# Altium schematic sheet SMPS power supply.SchDoc: SMPS power supply
size A3; DocumentNumber: MB1312; Revision: A-01; SheetNumber: 6; SheetTotal: 6; Project: NUCLEO-LXXXZX
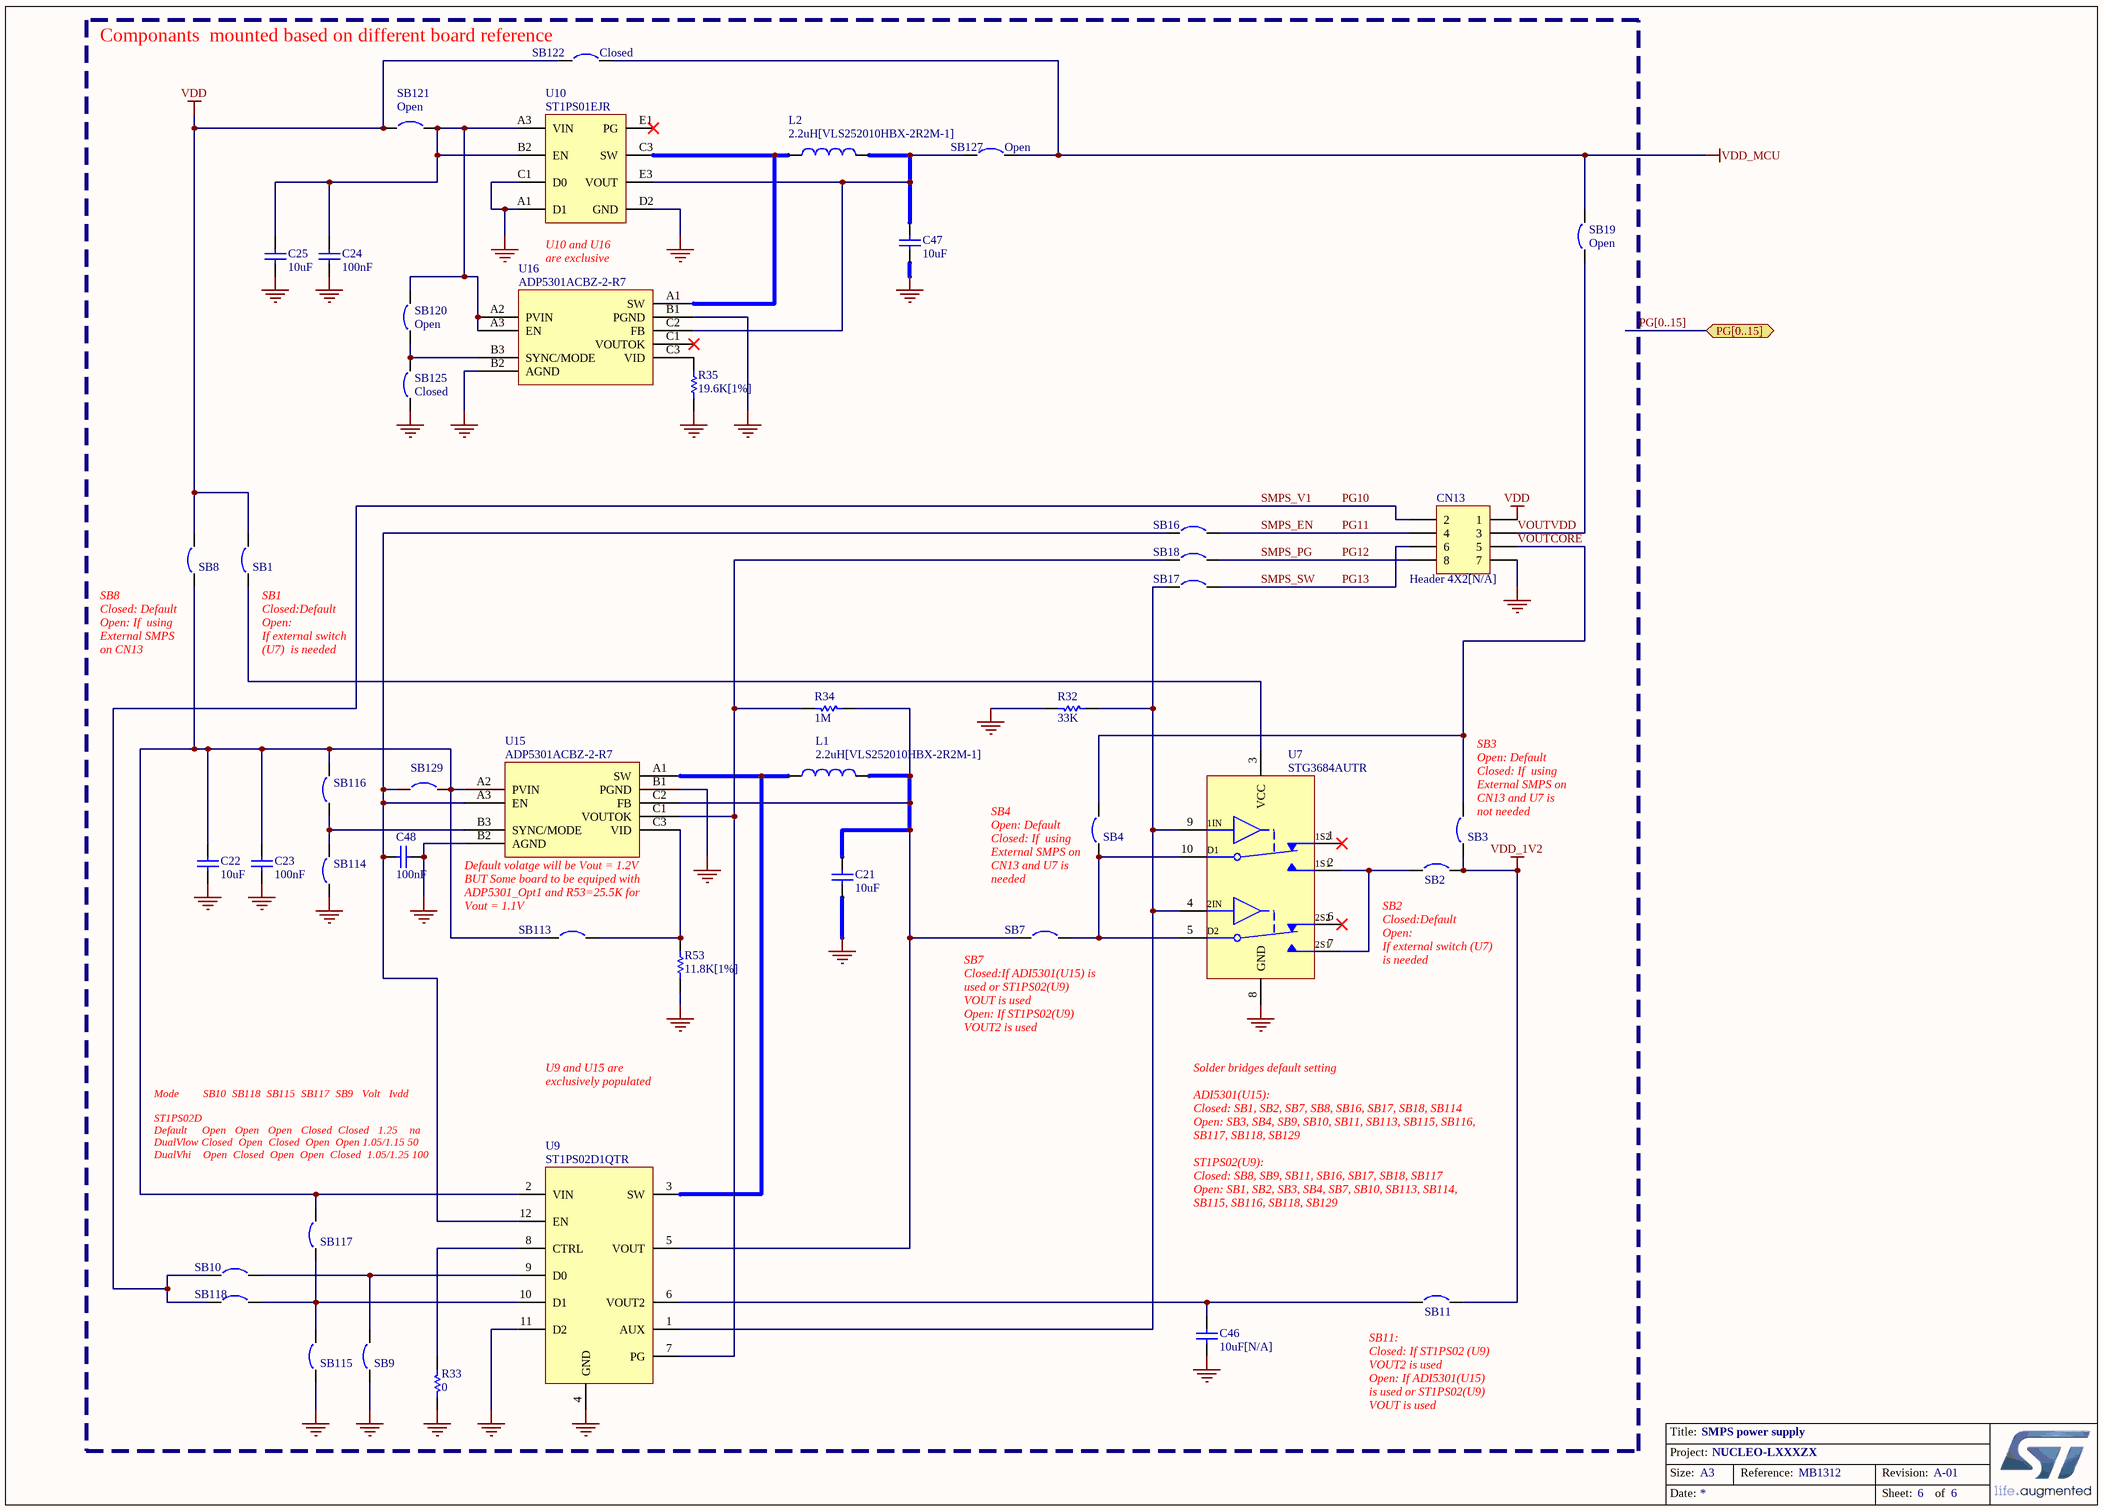
[diagram p0: SMPS power supply.SchDoc]

## Parts
C21  10uF  [0603C]
C22  10uF  [0603C]
C23  100nF  [0603C]
C24  100nF  [0603C]
C25  10uF  [0603C]
C46  10uF[N/A]  [0603C]
C47  10uF  [0603C]
C48  100nF  [0603C]
CN13  Header 4X2[N/A]  [HDR_4x2_2R54_V_M]
L1  2.2uH[VLS252010HBX-2R2M-1]  [L1008_L0805_CPT]
L2  2.2uH[VLS252010HBX-2R2M-1]  [L1008_L0805_CPT]
R32  33K  [0603R]
R33  0  [0603R]
R34  1M  [0603R]
R35  19.6K[1%]  [0603R]
R53  11.8K[1%]  [0603R]
SB1  Circuit Breaker  [SB_0603]  (value not drawn)
SB2  Circuit Breaker  [SB_0603]  (value not drawn)
SB3  Circuit Breaker  [SB_0603]  (value not drawn)
SB4  Circuit Breaker  [SB_0603]  (value not drawn)
SB7  Circuit Breaker  [SB_0603]  (value not drawn)
SB8  Circuit Breaker  [SB_0603]  (value not drawn)
SB9  Circuit Breaker  [SB_0603]  (value not drawn)
SB10  Circuit Breaker  [SB_0603]  (value not drawn)
SB11  Circuit Breaker  [SB_0603]  (value not drawn)
SB16  Circuit Breaker  [SB_0603]  (value not drawn)
SB17  Circuit Breaker  [SB_0603]  (value not drawn)
SB18  Circuit Breaker  [SB_0603]  (value not drawn)
SB19  Open  [SB_0603]
SB113  Open  [SB_0603]  (value not drawn)
SB114  Closed  [SB_0603]  (value not drawn)
SB115  Circuit Breaker  [SB_0603]  (value not drawn)
SB116  Open  [SB_0603]  (value not drawn)
SB117  Circuit Breaker  [SB_0603]  (value not drawn)
SB118  Circuit Breaker  [SB_0603]  (value not drawn)
SB120  Open  [SB_0603]
SB121  Open  [SB_0603]
SB122  Closed  [SB_0603]
SB125  Closed  [SB_0603]
SB127  Open  [SB_0603]
SB129  Open  [SB_0603]  (value not drawn)
U7  STG3684AUTR  [QFN40P180X140X55-10N]
U9  ST1PS02D1QTR  [QFN0P170X200X55-12N]
U10  ST1PS01EJR  [Flipchip8]
U15  ADP5301ACBZ-2-R7  [WLCSP-9ball]
U16  ADP5301ACBZ-2-R7  [WLCSP-9ball]

## Blocks framed on the sheet
Componants  mounted based on different board reference: C21-C25 C46-C48 CN13 L1 L2 R32-R35 R53 SB1-SB4 SB7-SB11 SB16-SB19 SB113-SB118 SB120-SB122 SB125 SB127 SB129 U7 U9 U10 U15 U16

## Ports
PG[0..15] (bidir)

## Nets
GND: C21.1 C22.1 C23.2 C24.2 C25.1 C46.1 C47.1 C48.2 CN13.7 R32.2 R33.1 R35.1 R53.1 SB9.1 SB114.1 SB115.1 SB125.1 U7.8(GND) U9.4(GND) U9.11(D2) U10.A1(D1) U10.C1(D0) U10.D2(GND) U15.B1(PGND) U15.B2(AGND) U16.B1(PGND) U16.B2(AGND)
VDD: CN13.1 SB1.2 SB8.2 SB121.1 SB122.1
VDD_1V2: SB2.2 SB3.1 SB11.2
VDD_MCU: SB19.2 SB122.2 SB127.2
PG10: CN13.2 SB10.1 SB118.1  [also labelled SMPS_V1]
PG11: CN13.4 SB16.2  [also labelled SMPS_EN]
PG12: CN13.8 SB18.2  [also labelled SMPS_PG]
PG13: CN13.6 SB17.2  [also labelled SMPS_SW]
VOUTCORE: CN13.5 SB3.2 SB4.2
VOUTVDD: CN13.3 SB19.1
NetC21_2: C21.2 L1.2 R34.1 SB7.1 U9.5(VOUT) U15.C2(FB)
NetC22_2: C22.2 C23.1 SB8.1 SB113.1 SB116.2 SB117.2 SB129.2 U9.2(VIN) U15.A2(PVIN)
NetC24_1: C24.1 C25.2 SB120.2 SB121.2 U10.A3(VIN) U10.B2(EN) U16.A2(PVIN) U16.A3(EN)
NetC46_2: C46.2 SB11.1 U9.6(VOUT2)
NetC47_2: C47.2 L2.2 SB127.1 U10.E3(VOUT) U16.C2(FB)
NetC48_1: C48.1 SB16.1 SB129.1 U9.12(EN) U15.A3(EN)
NetL1_1: L1.1 U9.3(SW) U15.A1(SW)
NetL2_1: L2.1 U10.C3(SW) U16.A1(SW)
NetR32_1: R32.1 SB17.1 U7.4(2IN) U7.9(1IN) U9.1(AUX)
NetR33_2: R33.2 U9.8(CTRL)
NetR34_2: R34.2 SB18.1 U9.7(PG) U15.C1(VOUTOK)
NetR35_2: R35.2 U16.C3(VID)
NetR53_2: R53.2 SB113.2 U15.C3(VID)
NetSB1_1: SB1.1 U7.3(VCC)
NetSB2_1: SB2.1 U7.2(1S1) U7.7(2S1)
NetSB4_1: SB4.1 SB7.2 U7.5(D2) U7.10(D1)
NetSB9_2: SB9.2 SB10.2 U9.9(D0)
NetSB114_2: SB114.2 SB116.1 U15.B3(SYNC/MODE)
NetSB115_2: SB115.2 SB117.1 SB118.2 U9.10(D1)
NetSB120_1: SB120.1 SB125.2 U16.B3(SYNC/MODE)

Not connected (* = marked no-connect by the designer): U7 1(1S2)* 6(2S2)*; U10 E1(PG)*; U16 C1(VOUTOK)*

## Buses and harness runs
bus PG[0..15] = port PG[0..15]

## Notes on the sheet
- U10 and U16 are exclusive
- (near SB1) SB1
  Closed:Default
  Open:
  If external switch (U7)  is needed
- (near SB8) SB8
  Closed: Default
  Open: If  using External SMPS on CN13
- (near SB3) SB3
  Open: Default
  Closed: If  using External SMPS on CN13 and U7 is not needed
- Default volatge will be Vout = 1.2V
  BUT Some board to be equiped with ADP5301_Opt1 and R53=25.5K for Vout = 1.1V
- (near SB4) SB4
  Open: Default
  Closed: If  using External SMPS on CN13 and U7 is needed
- (near SB2) SB2
  Closed:Default
  Open:
  If external switch (U7)  is needed
- U9 and U15 are exclusively populated
- (near SB7) SB7
  Closed:If ADI5301(U15) is used or ST1PS02(U9) VOUT is used
  Open: If ST1PS02(U9) VOUT2 is used
- (near SB117) Mode        SB10  SB118  SB115  SB117  SB9   Volt   Ivdd
  ST1PS02D
  Default     Open   Open   Open   Closed  Closed   1.25    na
  DualVlow Closed  Open  Closed  Open  Open 1.05/1.15 50
  DualVhi    Open  Closed  Open  Open  Closed  1.05/1.25 100
- Solder bridges default setting
  ADI5301(U15):
  Closed: SB1, SB2, SB7, SB8, SB16, SB17, SB18, SB114
  Open: SB3, SB4, SB9, SB10, SB11, SB113, SB115, SB116, SB117, SB118, SB129
  ST1PS02(U9):
  Closed: SB8, SB9, SB11, SB16, SB17, SB18, SB117
  Open: SB1, SB2, SB3, SB4, SB7, SB10, SB113, SB114, SB115, SB116, SB118, SB129
- (near SB11) SB11:
  Closed: If ST1PS02 (U9) VOUT2 is used
  Open: If ADI5301(U15) is used or ST1PS02(U9) VOUT is used
- Title:
- Project:
- Size:
- Date:
- A3
- Reference:
- Sheet:
- Revision:
- of

## Library data of the parts
C21 C22 C25 C46 C47 = Cap: Capacitor; Value: 10nF; Published: 8-Jun-2000; Revision: July-2002: Re-released for DXP Platform.; Publisher: Altium Limited
C23 C24 C48 = CAP_CC0603KRX7R9BB104: Capacitor SMD 0603 100000pF X7R 50V +/-10%; Manufacturer: YAGEO; Order code RS: 669-8767; Tolerance: 10%; Fitted: Yes; Manufacturer P/N: CC0603KRX7R9BB104; Order code Farnell: 1362556; Value: 100nF; Rated voltage: 50V; Technology: X7R; Temperature Max: +125癈; Temperature Min: -55癈; Order code Digikey: 311-1344-2-ND
CN13 = Header 4X2_CN: Header, 4-Pin, Dual row; Revision: 17-Jul-2002: Re-released for DXP Platform.; Publisher: Altium Limited
L1 L2 = Inductor: Manuf_1: TDK; Value: 2.2uH; Ordered by: Subcon; ECCN_US/EU: NA; Published: 8-Jun-2000; Revision: July-2002: Re-released for DXP Platform.; Publisher: Altium Limited; Manuf_Part_1: VLS252010HBX-2R2M-1
R32-R34 = Res1: Resistor; Value: 1K; Published: 8-Jun-2000; Revision: July-2002: Re-released for DXP Platform.; Publisher: Altium Limited
R35 R53 = res1: Resistor; Value: 1K; Published: 8-Jun-2000; Revision: July-2002: Re-released for DXP Platform.; Publisher: Altium Limited
SB1-SB4 SB7-SB11 SB16-SB18 SB115 SB117 SB118 = Circuit Breaker: Solder: NO; Published: 24-Mar-1999; Revision: July-2002: Re-released for DXP Platform.; Publisher: Altium Limited
SB19 SB113 SB116 SB120 SB121 SB127 SB129 = Circuit Breaker: Published: 24-Mar-1999; Revision: July-2002: Re-released for DXP Platform.; Publisher: Altium Limited
SB114 SB122 SB125 = Circuit Breaker_close: Circuit Breaker; Published: 24-Mar-1999; Revision: July-2002: Re-released for DXP Platform.; Publisher: Altium Limited
U7 = STG3684AUTR: Low voltage 0.5 O max dual SPDT switch with break-before-make; Manufacturer: ST; Order code RS: ...; Fitted: Yes; Manufacturer P/N: STG3684AUTR; Order code Farnell: ...; Temperature Min: -40癈; Temperature Max: +85癈; Order code Digikey: ...
U9 = ST1PS022D1QTR: 400mA Nano-Quiescent?Synchronous step-down converter  with voltage selection, power good, Aux Switch; Manufacturer: STMicroelectronics; Order code RS: ...; Manufacturer P/N: ST1PS02; Order code Farnell: ...
U10 = ST1PS01FJR: 400mA Nano-Quiescent?Synchronous step-down converter  with voltage selection and power good; Manufacturer: STMicroelectronics; Manufacturer P/N: ST1PS01EJR
U15 U16 = ADP5301: UL Step down regulator